# Altium project Aeon Lite.PrjPcb
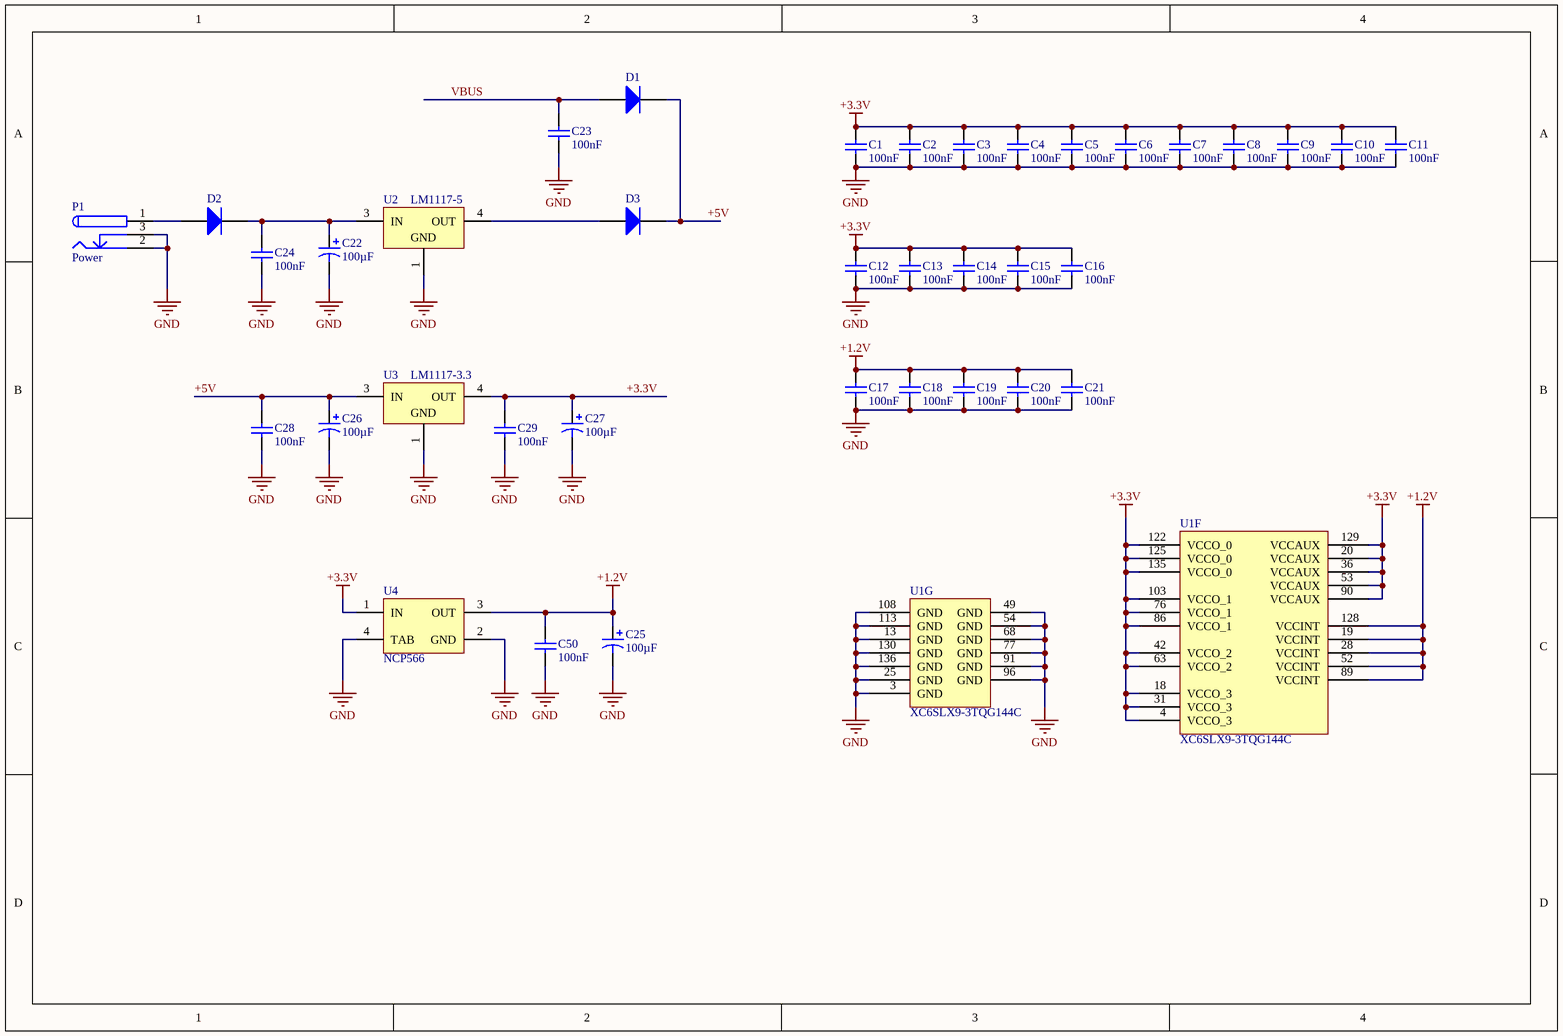
[diagram p0: Power Supply.SchDoc]
6 sheets, 165 parts. Net scope: global (net labels, ports and power ports of the same name join across sheets).
Board file: Board.PcbDoc
Sheets:
  Power Supply.SchDoc
  FPGA Banks.SchDoc
  Memory.SchDoc
  Controller.SchDoc
  VGA.SchDoc
  PS2.SchDoc

## Sheet Power Supply.SchDoc
size A4

### Parts
C1  value 100nF  [6-0805_n]  (hidden comment: Cap)
C2  value 100nF  [6-0805_n]  (hidden comment: Cap)
C3  value 100nF  [6-0805_n]  (hidden comment: Cap)
C4  value 100nF  [6-0805_n]  (hidden comment: Cap)
C5  value 100nF  [6-0805_n]  (hidden comment: Cap)
C6  value 100nF  [6-0805_n]  (hidden comment: Cap)
C7  value 100nF  [6-0805_n]  (hidden comment: Cap)
C8  value 100nF  [6-0805_n]  (hidden comment: Cap)
C9  value 100nF  [6-0805_n]  (hidden comment: Cap)
C10  value 100nF  [6-0805_n]  (hidden comment: Cap)
C11  value 100nF  [6-0805_n]  (hidden comment: Cap)
C12  value 100nF  [6-0805_n]  (hidden comment: Cap)
C13  value 100nF  [6-0805_n]  (hidden comment: Cap)
C14  value 100nF  [6-0805_n]  (hidden comment: Cap)
C15  value 100nF  [6-0805_n]  (hidden comment: Cap)
C16  value 100nF  [6-0805_n]  (hidden comment: Cap)
C17  value 100nF  [6-0805_n]  (hidden comment: Cap)
C18  value 100nF  [6-0805_n]  (hidden comment: Cap)
C19  value 100nF  [6-0805_n]  (hidden comment: Cap)
C20  value 100nF  [6-0805_n]  (hidden comment: Cap)
C21  value 100nF  [6-0805_n]  (hidden comment: Cap)
C22  value 100µF  [ECAP 6.3mm]  (hidden comment: Cap Pol3)
C23  value 100nF  [6-0805_n]  (hidden comment: Cap)
C24  value 100nF  [6-0805_n]  (hidden comment: Cap)
C25  value 100µF  [ECAP 6.3mm]  (hidden comment: Cap Pol3)
C26  value 100µF  [ECAP 6.3mm]  (hidden comment: Cap Pol3)
C27  value 100µF  [ECAP 6.3mm]  (hidden comment: Cap Pol3)
C28  value 100nF  [6-0805_n]  (hidden comment: Cap)
C29  value 100nF  [6-0805_n]  (hidden comment: Cap)
C50  value 100nF  [6-0805_n]  (hidden comment: Cap)
D1  Diode  [SMB]  (value not drawn)
D2  Diode  [SMB]  (value not drawn)
D3  Diode  [SMB]  (value not drawn)
P1  Power  [Power Jack]
U1  XC6SLX9-3TQG144C  [TQG144_N]  (parts F,G of 7)
U2  LM1117-5  [TD03B_M]
U3  LM1117-3.3  [TD03B_M]
U4  NCP566  [SOT223]

### Nets
+1.2V: C17.2 C18.2 C19.2 C20.2 C21.2 C25.1 C50.2 U1.19(VCCINT) U1.28(VCCINT) U1.52(VCCINT) U1.89(VCCINT) U1.128(VCCINT) U4.3(OUT)
+3.3V: C1.2 C2.2 C3.2 C4.2 C5.2 C6.2 C7.2 C8.2 C9.2 C10.2 C11.2 C12.2 C13.2 C14.2 C15.2 C16.2 C27.1 C29.2 U1.4(VCCO_3) U1.18(VCCO_3) U1.20(VCCAUX) U1.31(VCCO_3) U1.36(VCCAUX) U1.42(VCCO_2) U1.53(VCCAUX) U1.63(VCCO_2) U1.76(VCCO_1) U1.86(VCCO_1) U1.90(VCCAUX) U1.103(VCCO_1) U1.122(VCCO_0) U1.125(VCCO_0) U1.129(VCCAUX) U1.135(VCCO_0) U3.4(OUT) U4.1(IN)
+5V: C26.1 C28.2 D1.2(K) D3.2(K) U3.3(IN)
GND: C1.1 C2.1 C3.1 C4.1 C5.1 C6.1 C7.1 C8.1 C9.1 C10.1 C11.1 C12.1 C13.1 C14.1 C15.1 C16.1 C17.1 C18.1 C19.1 C20.1 C21.1 C22.2 C23.1 C24.1 C25.2 C26.2 C27.2 C28.1 C29.1 C50.1 P1.2 P1.3 U1.3(GND) U1.13(GND) U1.25(GND) U1.49(GND) U1.54(GND) U1.68(GND) U1.77(GND) U1.91(GND) U1.96(GND) U1.108(GND) U1.113(GND) U1.130(GND) U1.136(GND) U2.1(GND) U3.1(GND) U4.2(GND) U4.4(TAB)
VBUS: C23.2 D1.1(A)
NetC22_1: C22.1 C24.2 D2.2(K) U2.3(IN)
NetD2_1: D2.1(A) P1.1
NetD3_1: D3.1(A) U2.4(OUT)

### Notes on the sheet
- Title
- Size:
- Date:
- A4
- Number:
- Time:
- Revision:
- Sheet
- of
- File:

### Library data of the parts
C1-C21 C23 C24 C28 C29 C50 = Cap: Capacitor; Published: 8-Jun-2000; LatestRevisionDate: 17-Jul-2002; LatestRevisionNote: Re-released for DXP Platform.; PackageReference: RAD-0.3; Publisher: Altium Limited; PackageDescription: Radial Cap, Thru-Hole; 2 Leads; 0.3 in Pin Spacing
C22 C25-C27 = Cap Pol3: Polarized Capacitor (Surface Mount); Published: 8-Jun-2000; LatestRevisionDate: 29-May-2009; LatestRevisionNote: IPC-7351 Footprint Added.; PackageReference: C0805; Publisher: Altium Limited; PackageDescription: Chip Capacitor
D1-D3 = Diode: Default Diode; Published: 8-Jun-2000; LatestRevisionDate: 17-Jul-2002; LatestRevisionNote: Re-released for DXP Platform.; PackageVersion: Sep-1996; PackageReference: SMC; Publisher: Altium Limited; PackageDescription: DO-214-AB/SMC; 2 C-Bend Leads; Body 7.9 x 5.9 mm, inc. leads (LxW); Code_JEDEC: DO-214-AB
P1 = Power Jack
U1 = XC6SLX9-3TQG144C: Spartan-6 LX 1.2V FPGA, 102 User I/Os, 144-Pin TQFP (0.5mm Pitch), Speed Grade 3, Commercial Grade, Pb-Free; Published: 17-Nov-2009; DatasheetVersion: ver1.6, Nov-2010; PackageVersion: ver1.2, Jun-2004; PackageReference: TQG144; Publisher: Altium Limited; PackageDescription: 144-Pin Thin Quad Flat Pack (TQG144) - Pb-Free; Supplier 1: Digi-Key; Supplier Part Number 1: XC6SLX9-3TQG144C-ND; Code_JEDEC: MS-026-BFB; ComponentLink1Description: Manufacturer Link; ComponentLink1URL: http://www.xilinx.com; ComponentLink2Description: Spartan-6 Datasheet; ComponentLink2URL: http://www.xilinx.com/support/documentation/data_sheets/ds160.pdf; ComponentLink3Description: Spartan-6 Documents; ComponentLink3URL: http://www.xilinx.com/support/documentation/spartan-6.htm; ComponentLink4Description: Xilinx.com Home; ComponentLink4URL: http://www.xilinx.com
U2 U3 = LM1117DT-3.3: 800mA Low-Dropout Linear Regulator, 3-pin TO-252; Manufacturer: National Semiconductor; PackageTopMarking: NSUZXYTT*LM1117*DT-3.3; PowerWise: N; CompType: LDO IC; Published: 4-Dec-2008; DatasheetVersion: Apr-2006; PackageVersion: revD, Feb-2009; PackageReference: TD03B; Publisher: Altium Limited; PackageDescription: TO252, Molded, Jedec, 6.8 x 6.10 x 2.30mm Body, 3 Lead, 2.28mm Pitch, Surface Mount; Supplier 1: Farnell; Supplier Part Number 1: 9486275; Supplier 2: Farnell; Supplier Part Number 2: 1523829; PartNumber: LM1117DT-3.3; RoHS: N; PinCount: 3; Code_JEDEC: TO-252-AA; ComponentLink1Description: LM1117 Datasheet; ComponentLink1URL: http://www.national.com/ds/LM/LM1117.pdf; ComponentLink2Description: LM1117 Web Page; ComponentLink2URL: http://www.national.com/pf/LM/LM1117.html; ComponentLink3Description: TD03B Package Page; ComponentLink3URL: http://www.national.com/packaging/folders/td03b.html

## Sheet FPGA Banks.SchDoc
size A4
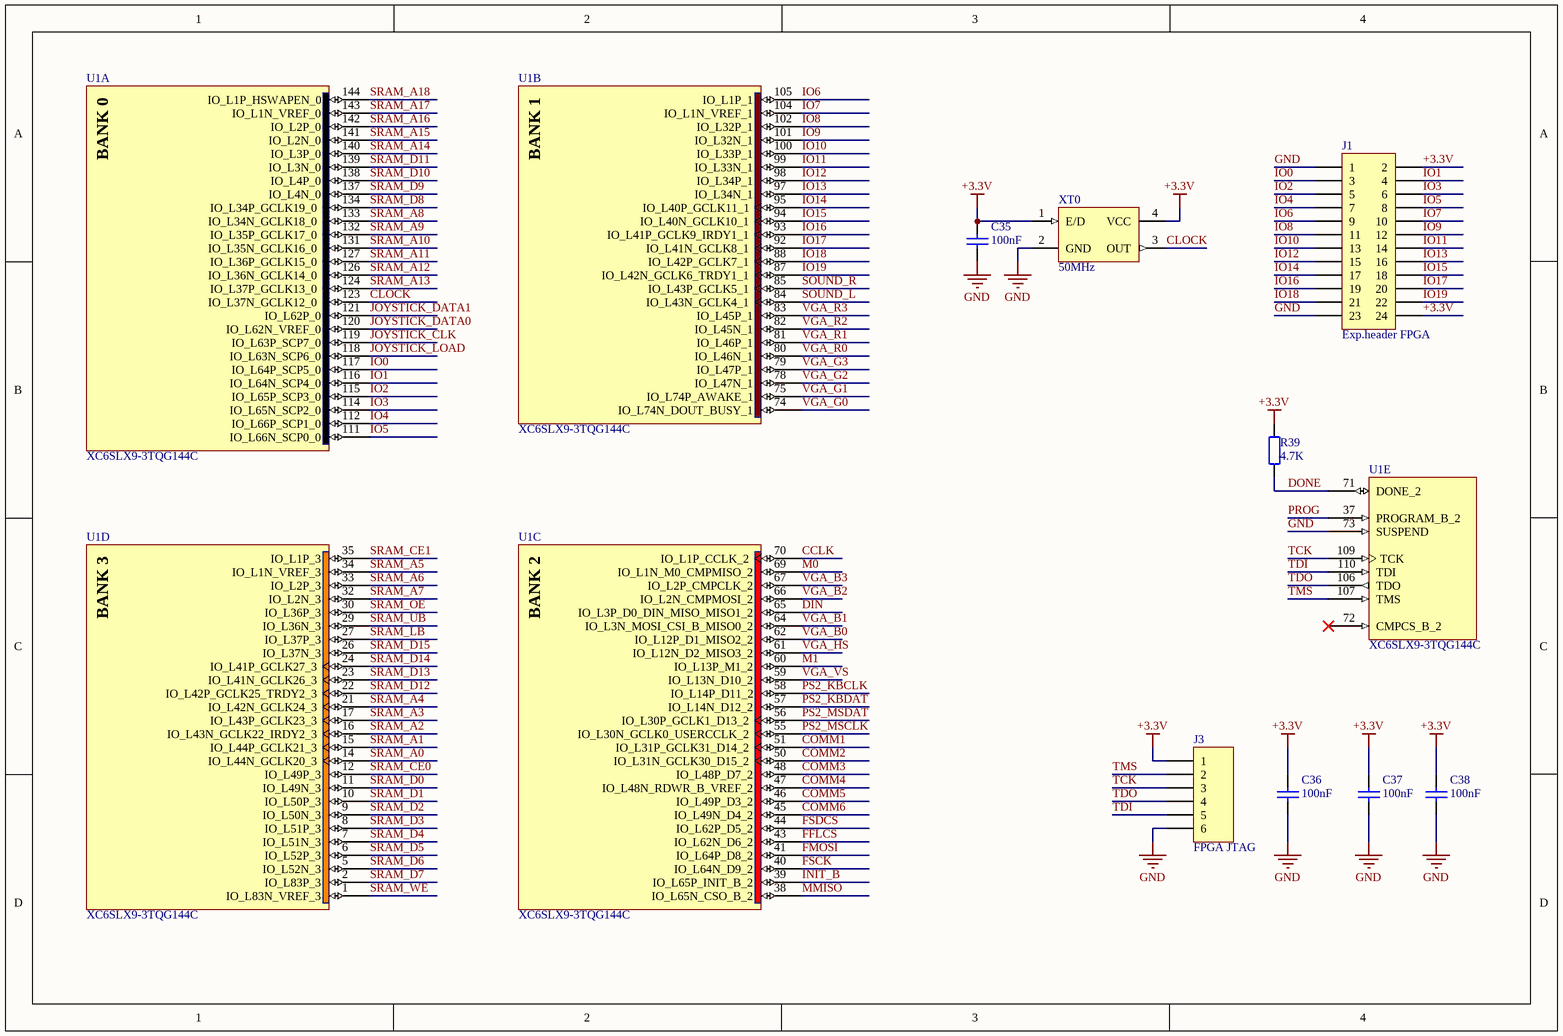
[diagram p1: FPGA Banks.SchDoc]

### Parts
C35  value 100nF  [6-0805_n]  (hidden comment: Cap)
C36  value 100nF  [6-0805_n]  (hidden comment: Cap)
C37  value 100nF  [6-0805_n]  (hidden comment: Cap)
C38  value 100nF  [6-0805_n]  (hidden comment: Cap)
J1  Exp.header FPGA  [HDR2X12]
J3  FPGA JTAG  [HDR1X6]
R39  value 4.7K  [6-0805_N]  (hidden comment: Res2)
U1  XC6SLX9-3TQG144C  [TQG144_N]  (parts A,B,C,D,E of 7)
XT0  value 50MHz  [Oscillator SMD 7x5mm]  (hidden comment: Oscillator)

### Nets
+3.3V: C35.2 C36.2 C37.2 C38.2 J1.2 J1.24 J3.1 R39.1 XT0.1(E/D) XT0.4(VCC)
GND: C35.1 C36.1 C37.1 C38.1 J1.1 J1.23 J3.6 U1.73(SUSPEND) XT0.2(GND)
CCLK: U1.70(IO_L1P_CCLK_2)
CLOCK: U1.123(IO_L37N_GCLK12_0) XT0.3(OUT)
COMM1: U1.51(IO_L31P_GCLK31_D14_2)
COMM2: U1.50(IO_L31N_GCLK30_D15_2)
COMM3: U1.48(IO_L48P_D7_2)
COMM4: U1.47(IO_L48N_RDWR_B_VREF_2)
COMM5: U1.46(IO_L49P_D3_2)
COMM6: U1.45(IO_L49N_D4_2)
DIN: U1.65(IO_L3P_D0_DIN_MISO_MISO1_2)
DONE: R39.2 U1.71(DONE_2)
FFLCS: U1.43(IO_L62N_D6_2)
FMOSI: U1.41(IO_L64P_D8_2)
FSCK: U1.40(IO_L64N_D9_2)
FSDCS: U1.44(IO_L62P_D5_2)
INIT_B: U1.39(IO_L65P_INIT_B_2)
IO0: J1.3 U1.117(IO_L64P_SCP5_0)
IO1: J1.4 U1.116(IO_L64N_SCP4_0)
IO2: J1.5 U1.115(IO_L65P_SCP3_0)
IO3: J1.6 U1.114(IO_L65N_SCP2_0)
IO4: J1.7 U1.112(IO_L66P_SCP1_0)
IO5: J1.8 U1.111(IO_L66N_SCP0_0)
IO6: J1.9 U1.105(IO_L1P_1)
IO7: J1.10 U1.104(IO_L1N_VREF_1)
IO8: J1.11 U1.102(IO_L32P_1)
IO9: J1.12 U1.101(IO_L32N_1)
IO10: J1.13 U1.100(IO_L33P_1)
IO11: J1.14 U1.99(IO_L33N_1)
IO12: J1.15 U1.98(IO_L34P_1)
IO13: J1.16 U1.97(IO_L34N_1)
IO14: J1.17 U1.95(IO_L40P_GCLK11_1)
IO15: J1.18 U1.94(IO_L40N_GCLK10_1)
IO16: J1.19 U1.93(IO_L41P_GCLK9_IRDY1_1)
IO17: J1.20 U1.92(IO_L41N_GCLK8_1)
IO18: J1.21 U1.88(IO_L42P_GCLK7_1)
IO19: J1.22 U1.87(IO_L42N_GCLK6_TRDY1_1)
JOYSTICK_CLK: U1.119(IO_L63P_SCP7_0)
JOYSTICK_DATA0: U1.120(IO_L62N_VREF_0)
JOYSTICK_DATA1: U1.121(IO_L62P_0)
JOYSTICK_LOAD: U1.118(IO_L63N_SCP6_0)
M0: U1.69(IO_L1N_M0_CMPMISO_2)
M1: U1.60(IO_L13P_M1_2)
MMISO: U1.38(IO_L65N_CSO_B_2)
PROG: U1.37(PROGRAM_B_2)
PS2_KBCLK: U1.58(IO_L14P_D11_2)
PS2_KBDAT: U1.57(IO_L14N_D12_2)
PS2_MSCLK: U1.55(IO_L30N_GCLK0_USERCCLK_2)
PS2_MSDAT: U1.56(IO_L30P_GCLK1_D13_2)
SOUND_L: U1.84(IO_L43N_GCLK4_1)
SOUND_R: U1.85(IO_L43P_GCLK5_1)
SRAM_A0: U1.14(IO_L44N_GCLK20_3)
SRAM_A1: U1.15(IO_L44P_GCLK21_3)
SRAM_A2: U1.16(IO_L43N_GCLK22_IRDY2_3)
SRAM_A3: U1.17(IO_L43P_GCLK23_3)
SRAM_A4: U1.21(IO_L42N_GCLK24_3)
SRAM_A5: U1.34(IO_L1N_VREF_3)
SRAM_A6: U1.33(IO_L2P_3)
SRAM_A7: U1.32(IO_L2N_3)
SRAM_A8: U1.133(IO_L34N_GCLK18_0)
SRAM_A9: U1.132(IO_L35P_GCLK17_0)
SRAM_A10: U1.131(IO_L35N_GCLK16_0)
SRAM_A11: U1.127(IO_L36P_GCLK15_0)
SRAM_A12: U1.126(IO_L36N_GCLK14_0)
SRAM_A13: U1.124(IO_L37P_GCLK13_0)
SRAM_A14: U1.140(IO_L3P_0)
SRAM_A15: U1.141(IO_L2N_0)
SRAM_A16: U1.142(IO_L2P_0)
SRAM_A17: U1.143(IO_L1N_VREF_0)
SRAM_A18: U1.144(IO_L1P_HSWAPEN_0)
SRAM_CE0: U1.12(IO_L49P_3)
SRAM_CE1: U1.35(IO_L1P_3)
SRAM_D0: U1.11(IO_L49N_3)
SRAM_D1: U1.10(IO_L50P_3)
SRAM_D2: U1.9(IO_L50N_3)
SRAM_D3: U1.8(IO_L51P_3)
SRAM_D4: U1.7(IO_L51N_3)
SRAM_D5: U1.6(IO_L52P_3)
SRAM_D6: U1.5(IO_L52N_3)
SRAM_D7: U1.2(IO_L83P_3)
SRAM_D8: U1.134(IO_L34P_GCLK19_0)
SRAM_D9: U1.137(IO_L4N_0)
SRAM_D10: U1.138(IO_L4P_0)
SRAM_D11: U1.139(IO_L3N_0)
SRAM_D12: U1.22(IO_L42P_GCLK25_TRDY2_3)
SRAM_D13: U1.23(IO_L41N_GCLK26_3)
SRAM_D14: U1.24(IO_L41P_GCLK27_3)
SRAM_D15: U1.26(IO_L37N_3)
SRAM_LB: U1.27(IO_L37P_3)
SRAM_OE: U1.30(IO_L36P_3)
SRAM_UB: U1.29(IO_L36N_3)
SRAM_WE: U1.1(IO_L83N_VREF_3)
TCK: J3.3 U1.109(TCK)
TDI: J3.5 U1.110(TDI)
TDO: J3.4 U1.106(TDO)
TMS: J3.2 U1.107(TMS)
VGA_B0: U1.62(IO_L12P_D1_MISO2_2)
VGA_B1: U1.64(IO_L3N_MOSI_CSI_B_MISO0_2)
VGA_B2: U1.66(IO_L2N_CMPMOSI_2)
VGA_B3: U1.67(IO_L2P_CMPCLK_2)
VGA_G0: U1.74(IO_L74N_DOUT_BUSY_1)
VGA_G1: U1.75(IO_L74P_AWAKE_1)
VGA_G2: U1.78(IO_L47N_1)
VGA_G3: U1.79(IO_L47P_1)
VGA_HS: U1.61(IO_L12N_D2_MISO3_2)
VGA_R0: U1.80(IO_L46N_1)
VGA_R1: U1.81(IO_L46P_1)
VGA_R2: U1.82(IO_L45N_1)
VGA_R3: U1.83(IO_L45P_1)
VGA_VS: U1.59(IO_L13N_D10_2)

Not connected (* = marked no-connect by the designer): U1 72(CMPCS_B_2)*

### Notes on the sheet
- Title
- Size:
- Date:
- A4
- Number:
- Time:
- Revision:
- Sheet
- of
- File:
- (in symbol XC6SLX9-3TQG144C, part A) BANK 0
- (in symbol XC6SLX9-3TQG144C, part B) BANK 1
- (in symbol XC6SLX9-3TQG144C, part C) BANK 2
- (in symbol XC6SLX9-3TQG144C, part D) BANK 3

### Library data of the parts
C35-C38 = Cap: Capacitor; Published: 8-Jun-2000; LatestRevisionDate: 17-Jul-2002; LatestRevisionNote: Re-released for DXP Platform.; PackageReference: RAD-0.3; Publisher: Altium Limited; PackageDescription: Radial Cap, Thru-Hole; 2 Leads; 0.3 in Pin Spacing
J1 = Header 12X2: Header, 12-Pin, Dual row; LatestRevisionDate: 17-Jul-2002; LatestRevisionNote: Re-released for DXP Platform.; Publisher: Altium Limited
J3 = Header 6: Header, 6-Pin; LatestRevisionDate: 17-Jul-2002; LatestRevisionNote: Re-released for DXP Platform.; Publisher: Altium Limited
R39 = Res2: Resistor; Published: 8-Jun-2000; LatestRevisionDate: 17-Jul-2002; LatestRevisionNote: Re-released for DXP Platform.; PackageReference: AXIAL-0.4; Publisher: Altium Limited; PackageDescription: Axial Device, Thru-Hole; 2 Leads; 0.4 in Pin Spacing
U1 = XC6SLX9-3TQG144C: as U1 on sheet Power Supply; Published: 17-Nov-2009; DatasheetVersion: ver1.6, Nov-2010; PackageVersion: ver1.2, Jun-2004; PackageReference: TQG144; Publisher: Altium Limited; PackageDescription: 144-Pin Thin Quad Flat Pack (TQG144) - Pb-Free; Supplier 1: Digi-Key; Supplier Part Number 1: XC6SLX9-3TQG144C-ND; Code_JEDEC: MS-026-BFB; ComponentLink1Description: Manufacturer Link; ComponentLink1URL: http://www.xilinx.com; ComponentLink2Description: Spartan-6 Datasheet; ComponentLink2URL: http://www.xilinx.com/support/documentation/data_sheets/ds160.pdf; ComponentLink3Description: Spartan-6 Documents; ComponentLink3URL: http://www.xilinx.com/support/documentation/spartan-6.htm; ComponentLink4Description: Xilinx.com Home; ComponentLink4URL: http://www.xilinx.com

## Sheet Memory.SchDoc
size A4
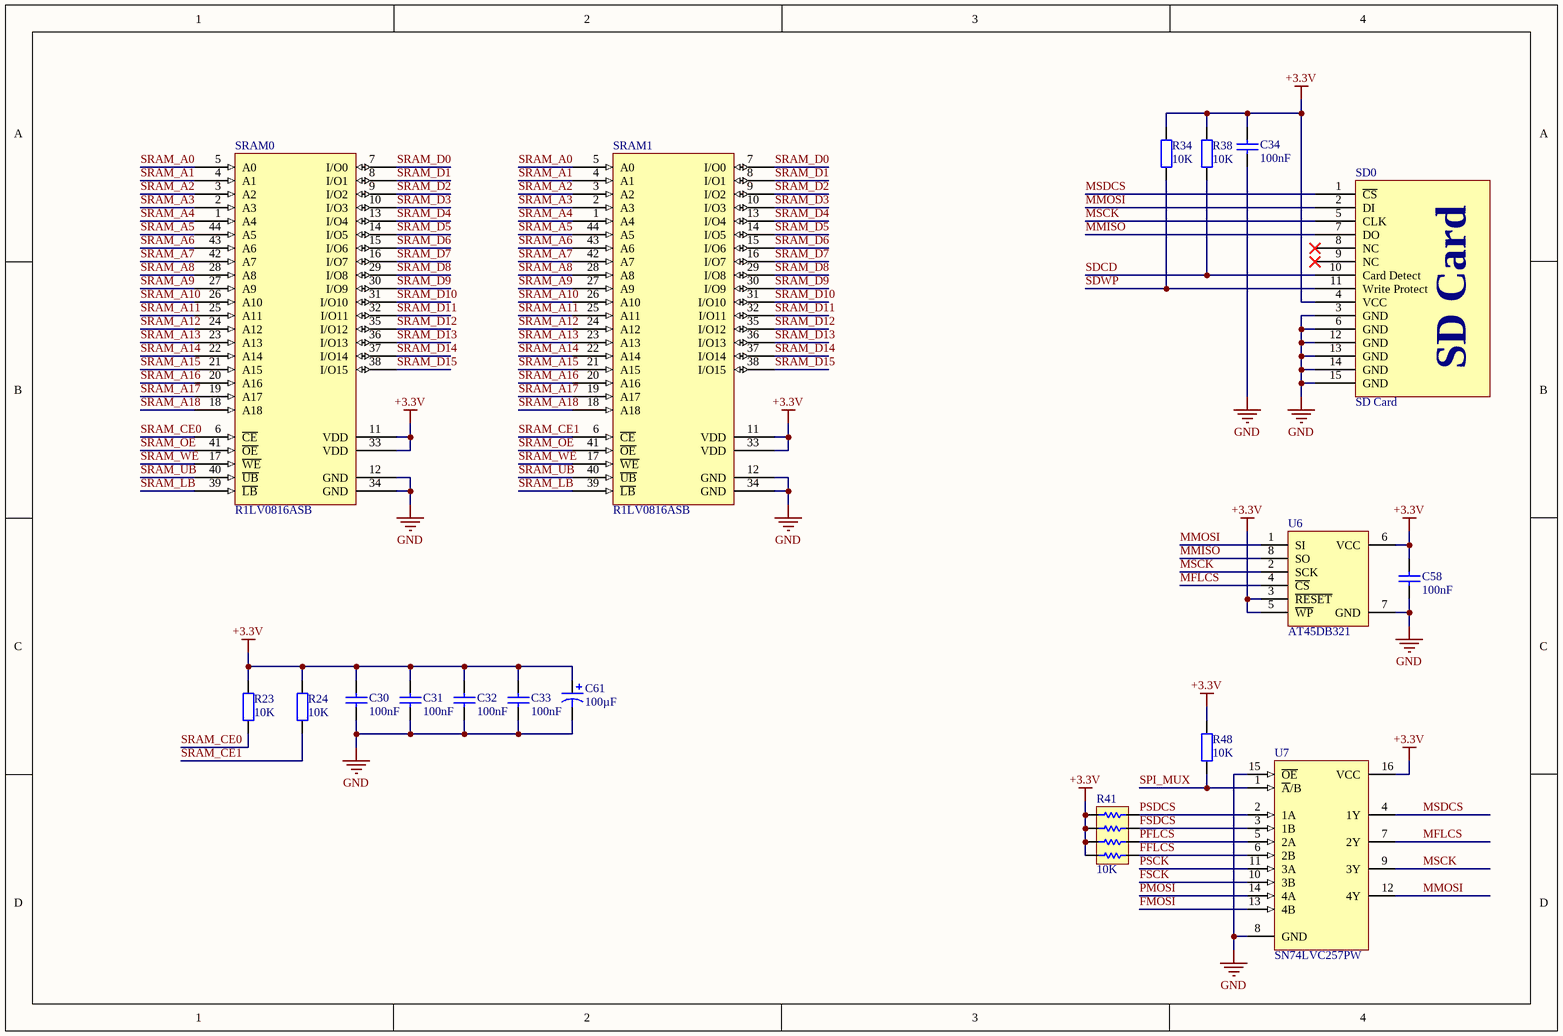
[diagram p2: Memory.SchDoc]

### Parts
C30  value 100nF  [6-0805_n]  (hidden comment: Cap)
C31  value 100nF  [6-0805_n]  (hidden comment: Cap)
C32  value 100nF  [6-0805_n]  (hidden comment: Cap)
C33  value 100nF  [6-0805_n]  (hidden comment: Cap)
C34  value 100nF  [6-0805_n]  (hidden comment: Cap)
C58  value 100nF  [6-0805_n]  (hidden comment: Cap)
C61  value 100µF  [ECAP 6.3mm]  (hidden comment: Cap Pol3)
R23  value 10K  [6-0805_N]  (hidden comment: Res2)
R24  value 10K  [6-0805_N]  (hidden comment: Res2)
R34  value 10K  [6-0805_N]  (hidden comment: Res2)
R38  value 10K  [6-0805_N]  (hidden comment: Res2)
R41  10K  [SMD 4 Resisor Network]
R48  value 10K  [6-0805_N]  (hidden comment: Res2)
SD0  SD Card  [SD-Card Connector OK]
SRAM0  R1LV0816ASB  [TSOP44]
SRAM1  R1LV0816ASB  [TSOP44]
U6  AT45DB321  [SOIC8]
U7  SN74LVC257PW  [PW016_N]

### Nets
+3.3V: C30.2 C31.2 C32.2 C33.2 C34.2 C58.2 C61.1 R23.1 R24.1 R34.1 R38.1 R41.1 R41.3 R41.5 R41.7 R48.1 SD0.4(VCC) SRAM0.11(VDD) SRAM0.33(VDD) SRAM1.11(VDD) SRAM1.33(VDD) U6.3(~{RESET}) U6.5(~{WP}) U6.6(VCC) U7.16(VCC)
GND: C30.1 C31.1 C32.1 C33.1 C34.1 C58.1 C61.2 SD0.3(GND) SD0.6(GND) SD0.12(GND) SD0.13(GND) SD0.14(GND) SD0.15(GND) SRAM0.12(GND) SRAM0.34(GND) SRAM1.12(GND) SRAM1.34(GND) U6.7(GND) U7.8(GND) U7.15(~{OE})
FFLCS: R41.8 U7.6(2B)
FMOSI: U7.13(4B)
FSCK: U7.10(3B)
FSDCS: R41.4 U7.3(1B)
MFLCS: U6.4(~{CS}) U7.7(2Y)
MMISO: SD0.7(DO) U6.8(SO)
MMOSI: SD0.2(DI) U6.1(SI) U7.12(4Y)
MSCK: SD0.5(CLK) U6.2(SCK) U7.9(3Y)
MSDCS: SD0.1(~{CS}) U7.4(1Y)
PFLCS: R41.6 U7.5(2A)
PMOSI: U7.14(4A)
PSCK: U7.11(3A)
PSDCS: R41.2 U7.2(1A)
SDCD: R38.2 SD0.10(Card_Detect)
SDWP: R34.2 SD0.11(Write_Protect)
SPI_MUX: R48.2 U7.1(~{A}/B)
SRAM_A0: SRAM0.5(A0) SRAM1.5(A0)
SRAM_A1: SRAM0.4(A1) SRAM1.4(A1)
SRAM_A2: SRAM0.3(A2) SRAM1.3(A2)
SRAM_A3: SRAM0.2(A3) SRAM1.2(A3)
SRAM_A4: SRAM0.1(A4) SRAM1.1(A4)
SRAM_A5: SRAM0.44(A5) SRAM1.44(A5)
SRAM_A6: SRAM0.43(A6) SRAM1.43(A6)
SRAM_A7: SRAM0.42(A7) SRAM1.42(A7)
SRAM_A8: SRAM0.28(A8) SRAM1.28(A8)
SRAM_A9: SRAM0.27(A9) SRAM1.27(A9)
SRAM_A10: SRAM0.26(A10) SRAM1.26(A10)
SRAM_A11: SRAM0.25(A11) SRAM1.25(A11)
SRAM_A12: SRAM0.24(A12) SRAM1.24(A12)
SRAM_A13: SRAM0.23(A13) SRAM1.23(A13)
SRAM_A14: SRAM0.22(A14) SRAM1.22(A14)
SRAM_A15: SRAM0.21(A15) SRAM1.21(A15)
SRAM_A16: SRAM0.20(A16) SRAM1.20(A16)
SRAM_A17: SRAM0.19(A17) SRAM1.19(A17)
SRAM_A18: SRAM0.18(A18) SRAM1.18(A18)
SRAM_CE0: R23.2 SRAM0.6(~{CE})
SRAM_CE1: R24.2 SRAM1.6(~{CE})
SRAM_D0: SRAM0.7(I/O0) SRAM1.7(I/O0)
SRAM_D1: SRAM0.8(I/O1) SRAM1.8(I/O1)
SRAM_D2: SRAM0.9(I/O2) SRAM1.9(I/O2)
SRAM_D3: SRAM0.10(I/O3) SRAM1.10(I/O3)
SRAM_D4: SRAM0.13(I/O4) SRAM1.13(I/O4)
SRAM_D5: SRAM0.14(I/O5) SRAM1.14(I/O5)
SRAM_D6: SRAM0.15(I/O6) SRAM1.15(I/O6)
SRAM_D7: SRAM0.16(I/O7) SRAM1.16(I/O7)
SRAM_D8: SRAM0.29(I/O8) SRAM1.29(I/O8)
SRAM_D9: SRAM0.30(I/O9) SRAM1.30(I/O9)
SRAM_D10: SRAM0.31(I/O10) SRAM1.31(I/O10)
SRAM_D11: SRAM0.32(I/O11) SRAM1.32(I/O11)
SRAM_D12: SRAM0.35(I/O12) SRAM1.35(I/O12)
SRAM_D13: SRAM0.36(I/O13) SRAM1.36(I/O13)
SRAM_D14: SRAM0.37(I/O14) SRAM1.37(I/O14)
SRAM_D15: SRAM0.38(I/O15) SRAM1.38(I/O15)
SRAM_LB: SRAM0.39(~{LB}) SRAM1.39(~{LB})
SRAM_OE: SRAM0.41(~{OE}) SRAM1.41(~{OE})
SRAM_UB: SRAM0.40(~{UB}) SRAM1.40(~{UB})
SRAM_WE: SRAM0.17(~{WE}) SRAM1.17(~{WE})

Not connected (* = marked no-connect by the designer): SD0 8(NC)* 9(NC)*

### Notes on the sheet
- Title
- Size:
- Date:
- A4
- Number:
- Time:
- Revision:
- Sheet
- of
- File:

### Library data of the parts
C30-C34 C58 = Cap: Capacitor; Published: 8-Jun-2000; LatestRevisionDate: 17-Jul-2002; LatestRevisionNote: Re-released for DXP Platform.; PackageReference: RAD-0.3; Publisher: Altium Limited; PackageDescription: Radial Cap, Thru-Hole; 2 Leads; 0.3 in Pin Spacing
C61 = Cap Pol3: Polarized Capacitor (Surface Mount); Published: 8-Jun-2000; LatestRevisionDate: 29-May-2009; LatestRevisionNote: IPC-7351 Footprint Added.; PackageReference: C0805; Publisher: Altium Limited; PackageDescription: Chip Capacitor
R23 R24 R34 R38 R48 = Res2: Resistor; Published: 8-Jun-2000; LatestRevisionDate: 17-Jul-2002; LatestRevisionNote: Re-released for DXP Platform.; PackageReference: AXIAL-0.4; Publisher: Altium Limited; PackageDescription: Axial Device, Thru-Hole; 2 Leads; 0.4 in Pin Spacing
R41 = SMD 4 Resistor Network
SD0 = SD Card Connector
SRAM0 SRAM1 = R1LV0816ASB: 8Mbit (512Kb x 16) Asynchron Static RAM
U6 = AT45DB321D
U7 = SN74LVC257PW: Quadruple 2-Line to 1-Line Data Selector/Multiplexer with 3-State Outputs; ComponentAvailability: Not Available; Published: 8-Jun-2000; LatestRevisionDate: 29-Mar-2007; LatestRevisionNote: IPC-7351 Footprint Added.; DatasheetVersion: Jul-1995; PackageVersion: Feb-1999; PackageReference: PW016; Publisher: Altium Limited; PackageDescription: 16-Pin Thin Small Outline Package 0.65 mm Pitch; ComponentLink1Description: Manufacturer Link; ComponentLink1URL: http://www.ti.com/; ComponentLink2Description: Discontinuation Notice; ComponentLink2URL: http://focus.ti.com/pdfs/mltry/obsolete.pdf

## Sheet Controller.SchDoc
size A4
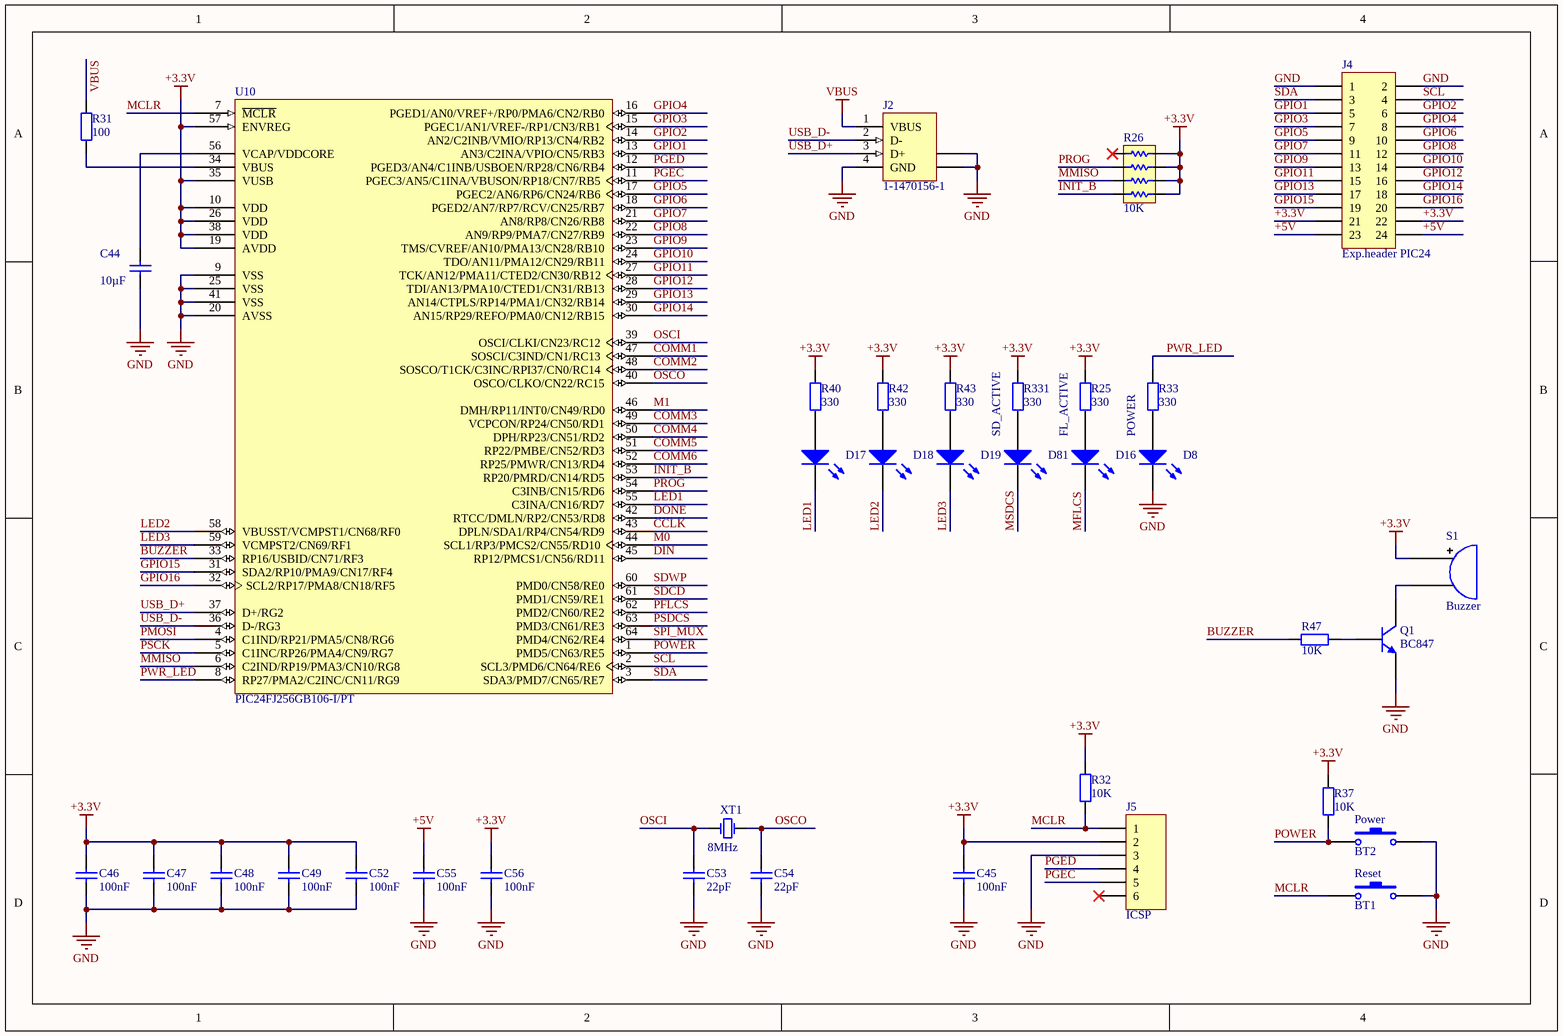
[diagram p3: Controller.SchDoc]

### Parts
C44  value 10µF  [6-0805_n]  (hidden comment: Cap)
C45  value 100nF  [6-0805_n]  (hidden comment: Cap)
C46  value 100nF  [6-0805_n]  (hidden comment: Cap)
C47  value 100nF  [6-0805_n]  (hidden comment: Cap)
C48  value 100nF  [6-0805_n]  (hidden comment: Cap)
C49  value 100nF  [6-0805_n]  (hidden comment: Cap)
C52  value 100nF  [6-0805_n]  (hidden comment: Cap)
C53  value 22pF  [6-0805_n]  (hidden comment: Cap)
C54  value 22pF  [6-0805_n]  (hidden comment: Cap)
C55  value 100nF  [6-0805_n]  (hidden comment: Cap)
C56  value 100nF  [6-0805_n]  (hidden comment: Cap)
D8  POWER  [HDR1X2]
D16  FL_ACTIVE  [HDR1X2]
D17  SD_ACTIVE  [6-0805_N]  (value not drawn)
D18  SD_ACTIVE  [6-0805_N]  (value not drawn)
D19  SD_ACTIVE  [6-0805_N]  (value not drawn)
D81  SD_ACTIVE  [HDR1X2]
J2  1-1470156-1  [440119]
J4  Exp.header PIC24  [HDR2X12]
J5  ICSP  [HDR1X6]
Power  BT2  [Push Button 6mm - Right Angle]
Q1  BC847  [SOT23_N]
R25  value 330  [6-0805_N]  (hidden comment: Res2)
R26  10K  [SMD 4 Resisor Network]
R31  value 100  [6-0805_N]  (hidden comment: Res2)
R32  value 10K  [6-0805_N]  (hidden comment: Res2)
R33  value 330  [6-0805_N]  (hidden comment: Res2)
R37  value 10K  [6-0805_N]  (hidden comment: Res2)
R40  value 330  [6-0805_N]  (hidden comment: Res2)
R42  value 330  [6-0805_N]  (hidden comment: Res2)
R43  value 330  [6-0805_N]  (hidden comment: Res2)
R47  value 10K  [RESC2012N]  (hidden comment: Resistor)
R331  value 330  [6-0805_N]  (hidden comment: Res2)
Reset  BT1  [Push Button 6mm]
S1  Buzzer  [Buzzer]
U10  PIC24FJ256GB106-I/PT  [TQFP-PT64_N]
XT1  value 8MHz  [Quartz HC-49]  (hidden comment: XTAL)

### Nets
+3.3V: C45.2 C46.1 C47.1 C48.1 C49.1 C52.1 C56.2 J4.21 J4.22 J5.2 R25.2 R26.2 R26.4 R26.6 R26.8 R32.2 R37.2 R40.2 R42.2 R43.2 R331.2 S1.1 U10.10(VDD) U10.19(AVDD) U10.26(VDD) U10.35(VUSB) U10.38(VDD) U10.57(ENVREG)
+5V: C55.2 J4.23 J4.24
GND: C44.1 C45.1 C46.2 C47.2 C48.2 C49.2 C52.2 C53.1 C54.1 C55.1 C56.1 D8.2(K) J2.4(GND) J2.5(SHLD) J2.6(SHLD) J4.1 J4.2 J5.3 Power.1 Q1.2(E) Reset.2 U10.9(VSS) U10.20(AVSS) U10.25(VSS) U10.41(VSS)
VBUS: J2.1(VBUS) R31.1
BUZZER: R47.1 U10.33(RP16/USBID/CN71/RF3)
CCLK: U10.43(DPLN/SDA1/RP4/CN54/RD9)
COMM1: U10.47(SOSCI/C3IND/CN1/RC13)
COMM2: U10.48(SOSCO/T1CK/C3INC/RPI37/CN0/RC14)
COMM3: U10.49(VCPCON/RP24/CN50/RD1)
COMM4: U10.50(DPH/RP23/CN51/RD2)
COMM5: U10.51(RP22/PMBE/CN52/RD3)
COMM6: U10.52(RP25/PMWR/CN13/RD4)
DIN: U10.45(RP12/PMCS1/CN56/RD11)
DONE: U10.42(RTCC/DMLN/RP2/CN53/RD8)
GPIO1: J4.5 U10.13(AN3/C2INA/VPIO/CN5/RB3)
GPIO2: J4.6 U10.14(AN2/C2INB/VMIO/RP13/CN4/RB2)
GPIO3: J4.7 U10.15(PGEC1/AN1/VREF-/RP1/CN3/RB1)
GPIO4: J4.8 U10.16(PGED1/AN0/VREF+/RP0/PMA6/CN2/RB0)
GPIO5: J4.9 U10.17(PGEC2/AN6/RP6/CN24/RB6)
GPIO6: J4.10 U10.18(PGED2/AN7/RP7/RCV/CN25/RB7)
GPIO7: J4.11 U10.21(AN8/RP8/CN26/RB8)
GPIO8: J4.12 U10.22(AN9/RP9/PMA7/CN27/RB9)
GPIO9: J4.13 U10.23(TMS/CVREF/AN10/PMA13/CN28/RB10)
GPIO10: J4.14 U10.24(TDO/AN11/PMA12/CN29/RB11)
GPIO11: J4.15 U10.27(TCK/AN12/PMA11/CTED2/CN30/RB12)
GPIO12: J4.16 U10.28(TDI/AN13/PMA10/CTED1/CN31/RB13)
GPIO13: J4.17 U10.29(AN14/CTPLS/RP14/PMA1/CN32/RB14)
GPIO14: J4.18 U10.30(AN15/RP29/REFO/PMA0/CN12/RB15)
GPIO15: J4.19 U10.31(SDA2/RP10/PMA9/CN17/RF4)
GPIO16: J4.20 U10.32(SCL2/RP17/PMA8/CN18/RF5)
INIT_B: R26.7 U10.53(RP20/PMRD/CN14/RD5)
LED1: D17.2(K) U10.55(C3INA/CN16/RD7)
LED2: D18.2(K) U10.58(VBUSST/VCMPST1/CN68/RF0)
LED3: D19.2(K) U10.59(VCMPST2/CN69/RF1)
M0: U10.44(SCL1/RP3/PMCS2/CN55/RD10)
M1: U10.46(DMH/RP11/INT0/CN49/RD0)
MCLR: J5.1 R32.1 Reset.1 U10.7(~{MCLR})
MFLCS: D16.2(K)
MMISO: R26.5 U10.6(C2IND/RP19/PMA3/CN10/RG8)
MSDCS: D81.2(K)
OSCI: C53.2 U10.39(OSCI/CLKI/CN23/RC12) XT1.2(OSC2)
OSCO: C54.2 U10.40(OSCO/CLKO/CN22/RC15) XT1.1(OSC1)
PFLCS: U10.62(PMD2/CN60/RE2)
PGEC: J5.5 U10.11(PGEC3/AN5/C1INA/VBUSON/RP18/CN7/RB5)
PGED: J5.4 U10.12(PGED3/AN4/C1INB/USBOEN/RP28/CN6/RB4)
PMOSI: U10.4(C1IND/RP21/PMA5/CN8/RG6)
POWER: Power.2 R37.1 U10.1(PMD5/CN63/RE5)
PROG: R26.3 U10.54(C3INB/CN15/RD6)
PSCK: U10.5(C1INC/RP26/PMA4/CN9/RG7)
PSDCS: U10.63(PMD3/CN61/RE3)
PWR_LED: R33.2 U10.8(RP27/PMA2/C2INC/CN11/RG9)
SCL: J4.4 U10.2(SCL3/PMD6/CN64/RE6)
SDA: J4.3 U10.3(SDA3/PMD7/CN65/RE7)
SDCD: U10.61(PMD1/CN59/RE1)
SDWP: U10.60(PMD0/CN58/RE0)
SPI_MUX: U10.64(PMD4/CN62/RE4)
USB_D+: J2.3(D+) U10.37(D+/RG2)
USB_D-: J2.2(D-) U10.36(D-/RG3)
NetC44_2: C44.2 U10.56(VCAP/VDDCORE)
NetD8_1: D8.1(A) R33.1
NetD16_1: D16.1(A) R25.1
NetD17_1: D17.1(A) R40.1
NetD18_1: D18.1(A) R42.1
NetD19_1: D19.1(A) R43.1
NetD81_1: D81.1(A) R331.1
NetQ1_1: Q1.1(B) R47.2
NetQ1_3: Q1.3(C) S1.2
NetR31_2: R31.2 U10.34(VBUS)

Not connected (* = marked no-connect by the designer): J5 6*; R26 1*

### Notes on the sheet
- Title
- Size:
- Date:
- A4
- Number:
- Time:
- Revision:
- Sheet
- of
- File:

### Library data of the parts
C44-C49 C52-C56 = Cap: Capacitor; Published: 8-Jun-2000; LatestRevisionDate: 17-Jul-2002; LatestRevisionNote: Re-released for DXP Platform.; PackageReference: RAD-0.3; Publisher: Altium Limited; PackageDescription: Radial Cap, Thru-Hole; 2 Leads; 0.3 in Pin Spacing
D8 D16-D19 D81 = LED0: Typical INFRARED GaAs LED; Published: 8-Jun-2000; LatestRevisionDate: 08-Jul-2005; LatestRevisionNote: Mech Layer 1 removed.; PackageReference: LED-0; Publisher: Altium Limited; PackageDescription: LED; 2 Leads
J2 = 1-1470156-1: USB 1.1, Right Angle, Thru-Hole, B Type, Receptacle, 4 Position, White; ContactMaterial: Phosphor Bronze; ContactPlating: Gold over Nickel; TerminationLength: 3.00mm [0.118in.]; PCB_Layout: Complies with manufacturer's recommendation.; DrillSize: Corresponds to nominal value.; PanelGround: Without; Published: 15-Jul-2004; DatasheetDocument: 02-Jun-2001; PackageDocument: 02-Jun-2001; PackageReference: 1-1470156; Publisher: Altium Limited; HousingMaterial: Glass-Filled Thermoplastic; ComponentLink1Description: Manufacturer Link; ComponentLink1URL: http://www.tycoelectronics.com/; ComponentLink2Description: Packaging Specification; ComponentLink2URL: http://ecommas.tycoelectronics.com/commerce/DocumentDelivery/DDEController?Action=showdoc&DocId=Customer+Drawing%7F1470156%7FO%7Ftif%7FEnglish%7FC_1470156_O.tif
J4 = Header 12X2: Header, 12-Pin, Dual row; LatestRevisionDate: 17-Jul-2002; LatestRevisionNote: Re-released for DXP Platform.; Publisher: Altium Limited
J5 = Header 6: Header, 6-Pin; LatestRevisionDate: 17-Jul-2002; LatestRevisionNote: Re-released for DXP Platform.; Publisher: Altium Limited
Power Reset = Push Button
Q1 = BF547: NPN 1 GHz Wideband Transistor; ComponentAvailability: Obsolete; Published: 17-Sep-2003; LatestRevisionDate: 12-Dec-2006; LatestRevisionNote: IPC-7351 Footprint Added.; DatasheetVersion: Sep-1995; PackageVersion: May-1999; PackageReference: SOT23; Publisher: Altium Limited; PackageDescription: 3-Pin SOT-23 Package 0.95 mm Pitch, 2.3 mm Lead Span; ComponentLink1Description: Manufacturer Link; ComponentLink1URL: http://www.semiconductors.philips.com/; ComponentLink2Description: Datasheet; ComponentLink2URL: http://www.semiconductors.philips.com/acrobat/datasheets/BF547_3.pdf; ComponentLink3Description: Discontinuation Notice; ComponentLink3URL: http://www.semiconductors.philips.com/pip/old/BF547.html
R25 R31-R33 R37 R40 R42 R43 R331 = Res2: Resistor; Published: 8-Jun-2000; LatestRevisionDate: 17-Jul-2002; LatestRevisionNote: Re-released for DXP Platform.; PackageReference: AXIAL-0.4; Publisher: Altium Limited; PackageDescription: Axial Device, Thru-Hole; 2 Leads; 0.4 in Pin Spacing
R26 = SMD 4 Resistor Network
S1 = Buzzer CEM-1206S/WT-1201: Magnetic Buzzer
U10 = PIC24FJ256GB106-I/PT: General Purpose 16-Bit Flash Microcontroller with USB On-The-Go, 256KB Flash, 16KB SRAM, 64-Pin TQFP, Industrial Temperature; Published: 29-Jan-2009; LatestRevisionDate: 07-Oct-2010; LatestRevisionNote: Updated to datasheet revision C, Dec-2009. Supplier links updated. Sch. pin names updated.; DatasheetVersion: revC, Dec-2009; PackageVersion: revBB, Aug-2009; PackageReference: TQFP-PT64; Publisher: Altium Limited; PackageDescription: 64-Lead Thin Plastic Quad Flat Pack (PT) - 10x10x1mm Body, 2.00mm [TQFP]; Supplier 1: Digi-Key; Supplier Part Number 1: PIC24FJ256GB106-I/PT-ND; Supplier 2: Farnell; Supplier Part Number 2: 1576868; Code_JEDEC: MS-026; ComponentLink1Description: Datasheet; ComponentLink1URL: http://ww1.microchip.com/downloads/en/DeviceDoc/39897c.pdf; ComponentLink2Description: Packaging Specification; ComponentLink2URL: http://www.microchip.com/stellent/groups/techpub_sg/documents/packagingspec/en012702.pdf; ComponentLink3Description: Microchip.com Home; ComponentLink3URL: http://www.microchip.com/
R47 = Resistor: Published: 8-Jun-2000; LatestRevisionDate: 17-Jul-2002; LatestRevisionNote: Re-released for DXP Platform.; PackageReference: AXIAL-0.4; Publisher: Altium Limited; PackageDescription: Axial Device, Thru-Hole; 2 Leads; 0.4 in Pin Spacing

## Sheet VGA.SchDoc
size A4
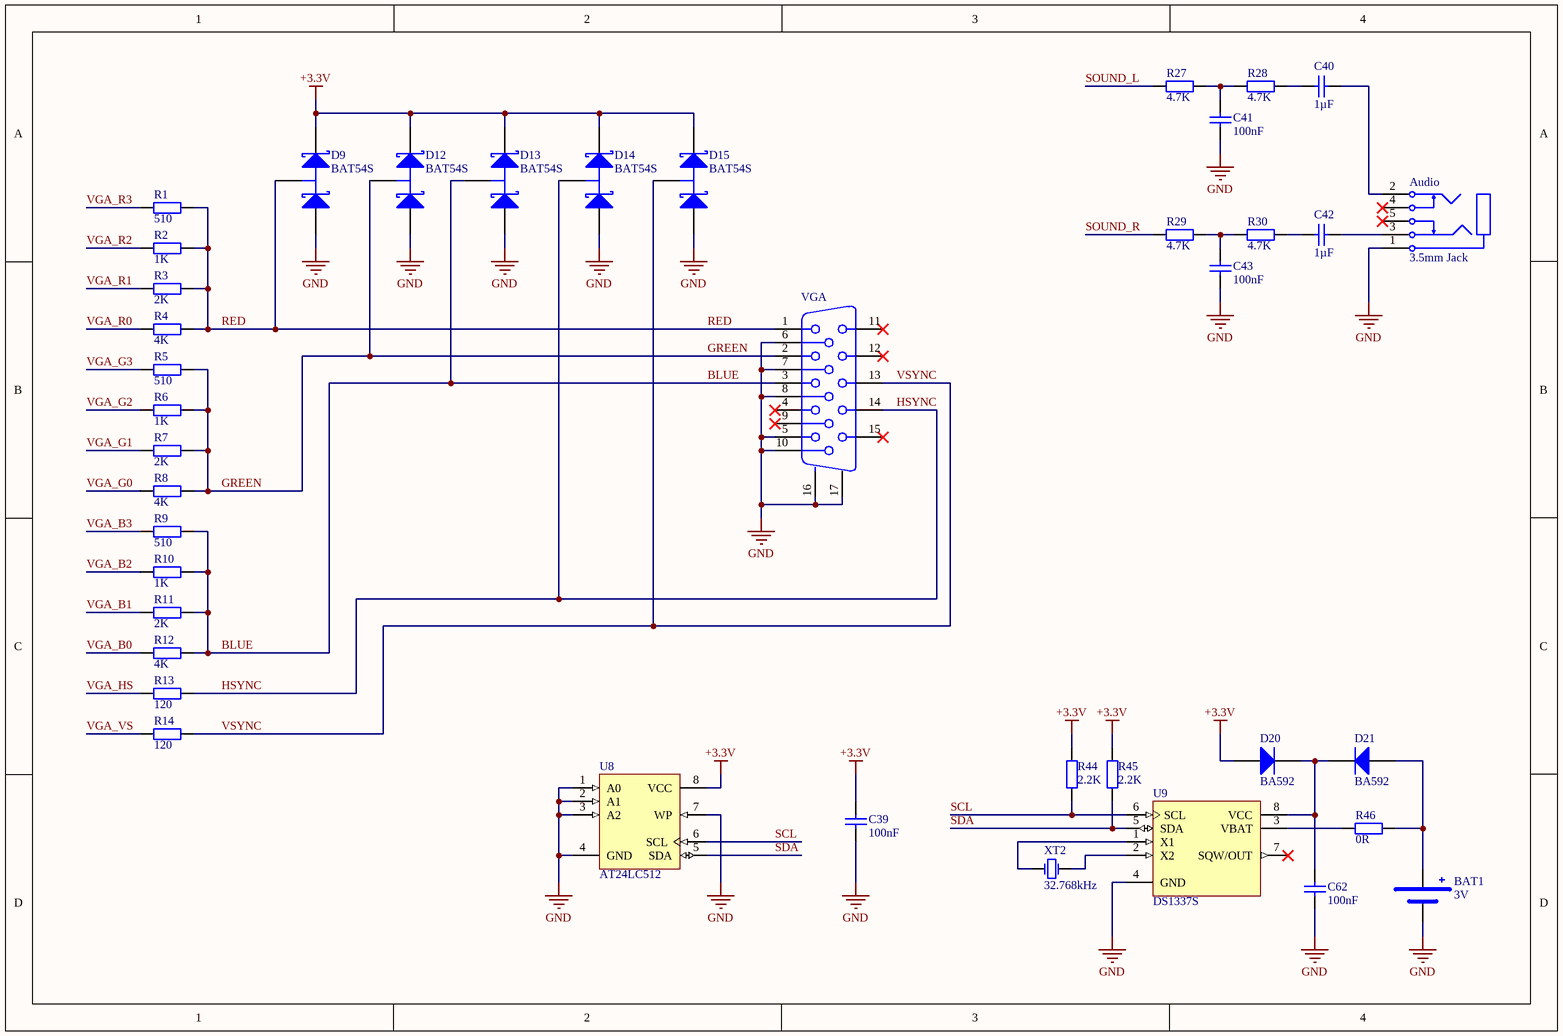
[diagram p4: VGA.SchDoc]

### Parts
Audio  3.5mm Jack  [SJ1-353XNG]
BAT1  3V  [CR2032 HOLDER - Vertical]
C39  value 100nF  [RESC2012N]  (hidden comment: Capacitor)
C40  value 1µF  [6-0805_n]  (hidden comment: Cap)
C41  value 100nF  [6-0805_n]  (hidden comment: Cap)
C42  value 1µF  [6-0805_n]  (hidden comment: Cap)
C43  value 100nF  [6-0805_n]  (hidden comment: Cap)
C62  value 100nF  [RESC2012N]  (hidden comment: Capacitor)
D9  BAT54S  [SOT23_N]
D12  BAT54S  [SOT23_N]
D13  BAT54S  [SOT23_N]
D14  BAT54S  [SOT23_N]
D15  BAT54S  [SOT23_N]
D20  BA592  [SOD-323]
D21  BA592  [SOD-323]
R1  value 510  [6-0805_N]  (hidden comment: Res2)
R2  value 1K  [6-0805_N]  (hidden comment: Res2)
R3  value 2K  [6-0805_N]  (hidden comment: Res2)
R4  value 4K  [6-0805_N]  (hidden comment: Res2)
R5  value 510  [6-0805_N]  (hidden comment: Res2)
R6  value 1K  [6-0805_N]  (hidden comment: Res2)
R7  value 2K  [6-0805_N]  (hidden comment: Res2)
R8  value 4K  [6-0805_N]  (hidden comment: Res2)
R9  value 510  [6-0805_N]  (hidden comment: Res2)
R10  value 1K  [6-0805_N]  (hidden comment: Res2)
R11  value 2K  [6-0805_N]  (hidden comment: Res2)
R12  value 4K  [6-0805_N]  (hidden comment: Res2)
R13  value 120  [6-0805_N]  (hidden comment: Res2)
R14  value 120  [6-0805_N]  (hidden comment: Res2)
R27  value 4.7K  [6-0805_N]  (hidden comment: Res2)
R28  value 4.7K  [6-0805_N]  (hidden comment: Res2)
R29  value 4.7K  [6-0805_N]  (hidden comment: Res2)
R30  value 4.7K  [6-0805_N]  (hidden comment: Res2)
R44  value 2.2K  [RESC2012N]  (hidden comment: Resistor)
R45  value 2.2K  [RESC2012N]  (hidden comment: Resistor)
R46  value 0R  [RESC2012N]  (hidden comment: Resistor)
U8  AT24LC512  [8S1_N]
U9  DS1337S  [SOIC8N_N]
VGA  Video  [VGA Connector]  (value not drawn)
XT2  value 32.768kHz  [SMD Clock Quarz]  (hidden comment: XTAL)

### Nets
+3.3V: C39.1 D9.2(K) D12.2(K) D13.2(K) D14.2(K) D15.2(K) D20.2(A) R44.2 R45.2 U8.8(VCC)
GND: Audio.1 BAT1.2 C39.2 C41.1 C43.1 C62.2 D9.1(A) D12.1(A) D13.1(A) D14.1(A) D15.1(A) U8.1(A0) U8.2(A1) U8.3(A2) U8.4(GND) U8.7(WP) U9.4(GND) VGA.5 VGA.6 VGA.7 VGA.8 VGA.10 VGA.16(MH1) VGA.17(MH2)
BLUE: D13.3(C) R9.1 R10.1 R11.1 R12.1 VGA.3
GREEN: D12.3(C) R5.1 R6.1 R7.1 R8.1 VGA.2
HSYNC: D14.3(C) R13.1 VGA.14
RED: D9.3(C) R1.1 R2.1 R3.1 R4.1 VGA.1
SCL: R44.1 U8.6(SCL) U9.6(SCL)
SDA: R45.1 U8.5(SDA) U9.5(SDA)
SOUND_L: R27.1
SOUND_R: R29.1
VGA_B0: R12.2
VGA_B1: R11.2
VGA_B2: R10.2
VGA_B3: R9.2
VGA_G0: R8.2
VGA_G1: R7.2
VGA_G2: R6.2
VGA_G3: R5.2
VGA_HS: R13.2
VGA_R0: R4.2
VGA_R1: R3.2
VGA_R2: R2.2
VGA_R3: R1.2
VGA_VS: R14.2
VSYNC: D15.3(C) R14.1 VGA.13
NetAudio_2: Audio.2 C40.1
NetAudio_3: Audio.3 C42.1
NetBAT1_1: BAT1.1 D21.2(A) R46.1
NetC40_2: C40.2 R28.2
NetC41_2: C41.2 R27.2 R28.1
NetC42_2: C42.2 R30.1
NetC43_2: C43.2 R29.2 R30.2
NetC62_1: C62.1 D20.1(K) D21.1(K) U9.8(VCC)
NetR46_2: R46.2 U9.3(VBAT)
NetU9_1: U9.1(X1) XT2.1(OSC1)
NetU9_2: U9.2(X2) XT2.2(OSC2)

Not connected (* = marked no-connect by the designer): Audio 4* 5*; U9 7(SQW/OUT)*; VGA 4* 9* 11* 12* 15*

### Notes on the sheet
- Title
- Size:
- Date:
- A4
- Number:
- Time:
- Revision:
- Sheet
- of
- File:

### Library data of the parts
Audio = Phono Jack
BAT1 = CR2032 Battery
C40-C43 = Cap: Capacitor; Published: 8-Jun-2000; LatestRevisionDate: 17-Jul-2002; LatestRevisionNote: Re-released for DXP Platform.; PackageReference: RAD-0.3; Publisher: Altium Limited; PackageDescription: Radial Cap, Thru-Hole; 2 Leads; 0.3 in Pin Spacing
D9 D12-D15 = BAT54S: Schottky Barrier Double Diode; Published: 17-Sep-2003; LatestRevisionDate: 12-Dec-2006; LatestRevisionNote: IPC-7351 Footprint Added.; DatasheetVersion: 4-Mar-2002; PackageVersion: May-1999; PackageReference: SOT23; Publisher: Altium Limited; PackageDescription: 3-Pin SOT-23 Package 0.95 mm Pitch, 2.3 mm Lead Span; ComponentLink1Description: Manufacturer Link; ComponentLink1URL: http://www.semiconductors.philips.com/; ComponentLink2Description: Datasheet; ComponentLink2URL: http://www.semiconductors.philips.com/acrobat/datasheets/BAT54_SERIES_4.pdf
D20 D21 = BA592: Silicon RF Switching Diode for VHF Band Switching in TV/VTR Tuners; Published: 21-Mar-2003; LatestRevisionDate: 19-Mar-2004; LatestRevisionNote: Silkscreen size reduced.; DatasheetDocument: Oct-1999; PackageDocument: Sep-2000; PackageReference: SOD-323; Publisher: Altium Limited; ComponentLink1Description: Manufacturer Link; ComponentLink1URL: http://www.infineon.com/; ComponentLink2Description: Datasheet; ComponentLink2URL: http://www.infineon.com/upload/Document/cmc_upload/documents/080/120/ba592_ba892series_1.pdf
R1-R14 R27-R30 = Res2: Resistor; Published: 8-Jun-2000; LatestRevisionDate: 17-Jul-2002; LatestRevisionNote: Re-released for DXP Platform.; PackageReference: AXIAL-0.4; Publisher: Altium Limited; PackageDescription: Axial Device, Thru-Hole; 2 Leads; 0.4 in Pin Spacing
U8 = AT24C01BN-SP25-B: 1Kbit (128 x 8), 2-wire Bus Automotive Serial EEPROM with Write Protect, 2.5V, 8-Pin SOIC, Bulk; Published: 20-Sep-2010; DatasheetVersion: 8517C,  Jan-2009; PackageVersion: revC, Mar-2005; PackageReference: 8S1; Publisher: Altium Limited; PackageDescription: 8-Lead (0.150" Wide Body), Plastic Gull Wing Small Outline (JEDEC SOIC); Code_JEDEC: MS-012-AA; Code_IPC: SOIC127P600-8; ComponentLink1Description: Manufacturer Link; ComponentLink1URL: http://www.atmel.com/products/serial/default.asp; ComponentLink2Description: Datasheet; ComponentLink2URL: http://www.atmel.com/dyn/resources/prod_documents/doc8517.pdf; ComponentLink3Description: Atmel.com Home; ComponentLink3URL: http://www.atmel.com
U9 = DS1307Z: 64 X 8 Serial Real-Time Clock; Published: 13-Oct-2000; LatestRevisionDate: 13-Apr-2006; LatestRevisionNote: IPC-7351 Footprint Added.; DatasheetVersion: 10-Aug-1999; PackageVersion: 1999; PackageReference: SOIC8N; Publisher: Altium Limited; PackageDescription: 8-Pin Small Outline Integrated Circuit 1.27 mm Pitch; Code_IPC: SOIC127P600-8; ComponentLink1Description: Manufacturer Link; ComponentLink1URL: http://www.maxim-ic.com/; ComponentLink2Description: Datasheet; ComponentLink2URL: http://pdfserv.maxim-ic.com/en/ds/DS1307.pdf; ComponentLink3Description: Discontinuation Notice; ComponentLink3URL: http://www.maxim-ic.com/qa/pdfs/non-obsolescence-letter.pdf
VGA = VGA Connector
C39 C62 = Capacitor: Published: 8-Jun-2000; LatestRevisionDate: 17-Jul-2002; LatestRevisionNote: Re-released for DXP Platform.; PackageReference: RAD-0.3; Publisher: Altium Limited; PackageDescription: Radial Cap, Thru-Hole; 2 Leads; 0.3 in Pin Spacing
R44-R46 = Resistor: Published: 8-Jun-2000; LatestRevisionDate: 17-Jul-2002; LatestRevisionNote: Re-released for DXP Platform.; PackageReference: AXIAL-0.4; Publisher: Altium Limited; PackageDescription: Axial Device, Thru-Hole; 2 Leads; 0.4 in Pin Spacing

## Sheet PS2.SchDoc
size A4
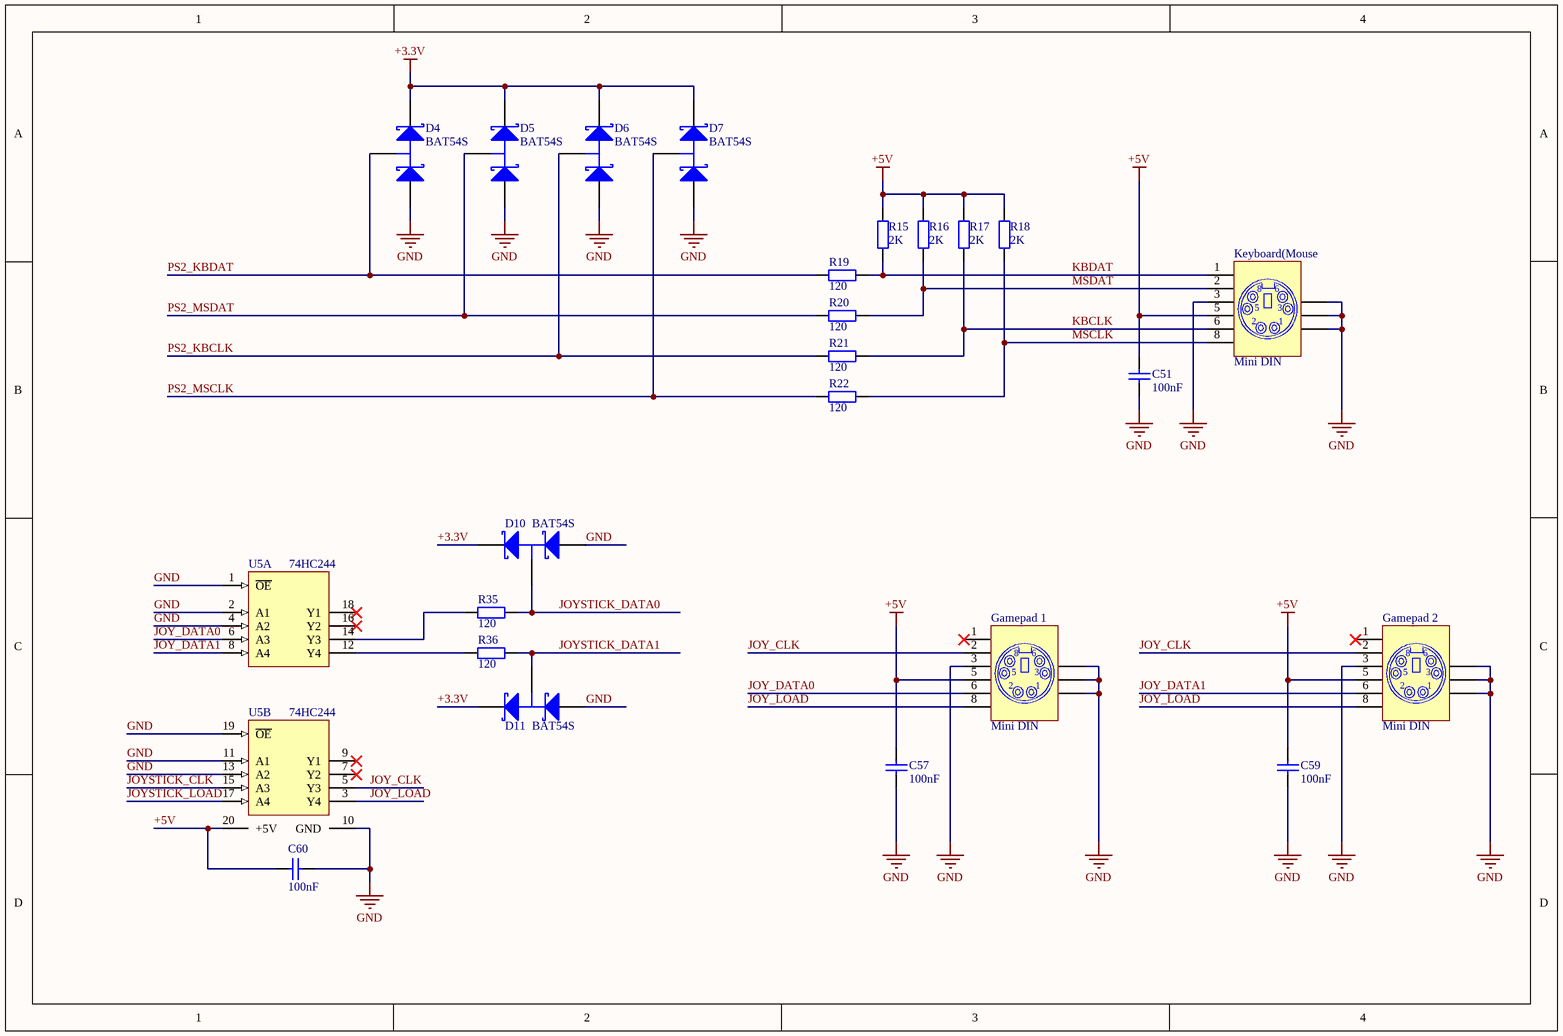
[diagram p5: PS2.SchDoc]

### Parts
C51  value 100nF  [6-0805_n]  (hidden comment: Cap)
C57  value 100nF  [6-0805_n]  (hidden comment: Cap)
C59  value 100nF  [6-0805_n]  (hidden comment: Cap)
C60  value 100nF  [6-0805_n]  (hidden comment: Cap)
D4  BAT54S  [SOT23_N]
D5  BAT54S  [SOT23_N]
D6  BAT54S  [SOT23_N]
D7  BAT54S  [SOT23_N]
D10  BAT54S  [SOT23_N]
D11  BAT54S  [SOT23_N]
Gamepad_1  Mini DIN  [Mini DIN PS/2]
Gamepad_2  Mini DIN  [Mini DIN PS/2]
Keyboard(Mouse  Mini DIN  [Mini DIN PS/2]
R15  value 2K  [6-0805_N]  (hidden comment: Res2)
R16  value 2K  [6-0805_N]  (hidden comment: Res2)
R17  value 2K  [6-0805_N]  (hidden comment: Res2)
R18  value 2K  [6-0805_N]  (hidden comment: Res2)
R19  value 120  [6-0805_N]  (hidden comment: Res2)
R20  value 120  [6-0805_N]  (hidden comment: Res2)
R21  value 120  [6-0805_N]  (hidden comment: Res2)
R22  value 120  [6-0805_N]  (hidden comment: Res2)
R35  value 120  [6-0805_N]  (hidden comment: Res2)
R36  value 120  [6-0805_N]  (hidden comment: Res2)
U5  74HC244  [948E-02_N]  (parts A,B of 2)

### Nets
+3.3V: D4.2(K) D5.2(K) D6.2(K) D7.2(K) D10.2(K) D11.2(K)
+5V: C51.2 C57.2 C59.2 C60.2 Gamepad_1.5 Gamepad_2.5 Keyboard(Mouse.5 R15.1 R16.1 R17.1 R18.1 U5.20(VDD)
GND: C51.1 C57.1 C59.1 C60.1 D4.1(A) D5.1(A) D6.1(A) D7.1(A) D10.1(A) D11.1(A) Gamepad_1.3 Gamepad_1.MH1 Gamepad_1.MH2 Gamepad_1.MH3 Gamepad_2.3 Gamepad_2.MH1 Gamepad_2.MH2 Gamepad_2.MH3 Keyboard(Mouse.3 Keyboard(Mouse.MH1 Keyboard(Mouse.MH2 Keyboard(Mouse.MH3 U5.1(~{OE}) U5.2(A1) U5.4(A2) U5.10(GND) U5.11(A1) U5.13(A2) U5.19(~{OE})
JOY_CLK: Gamepad_1.2 Gamepad_2.2 U5.5(Y3)
JOY_DATA0: Gamepad_1.6 U5.6(A3)
JOY_DATA1: Gamepad_2.6 U5.8(A4)
JOY_LOAD: Gamepad_1.8 Gamepad_2.8 U5.3(Y4)
JOYSTICK_CLK: U5.15(A3)
JOYSTICK_DATA0: D10.3(C) R35.1
JOYSTICK_DATA1: D11.3(C) R36.1
JOYSTICK_LOAD: U5.17(A4)
KBCLK: Keyboard(Mouse.6 R17.2 R21.2
KBDAT: Keyboard(Mouse.1 R15.2 R19.2
MSCLK: Keyboard(Mouse.8 R18.2 R22.2
MSDAT: Keyboard(Mouse.2 R16.2 R20.2
PS2_KBCLK: D6.3(C) R21.1
PS2_KBDAT: D4.3(C) R19.1
PS2_MSCLK: D7.3(C) R22.1
PS2_MSDAT: D5.3(C) R20.1
NetR35_2: R35.2 U5.14(Y3)
NetR36_2: R36.2 U5.12(Y4)

Not connected (* = marked no-connect by the designer): Gamepad_1 1*; Gamepad_2 1*; U5 7(Y2)* 9(Y1)* 16(Y2)* 18(Y1)*

### Notes on the sheet
- Title
- Size:
- Date:
- A4
- Number:
- Time:
- Revision:
- Sheet
- of
- File:

### Library data of the parts
C51 C57 C59 C60 = Cap: Capacitor; Published: 8-Jun-2000; LatestRevisionDate: 17-Jul-2002; LatestRevisionNote: Re-released for DXP Platform.; PackageReference: RAD-0.3; Publisher: Altium Limited; PackageDescription: Radial Cap, Thru-Hole; 2 Leads; 0.3 in Pin Spacing
D4-D7 D10 D11 = BAT54S: Schottky Barrier Double Diode; Published: 17-Sep-2003; LatestRevisionDate: 12-Dec-2006; LatestRevisionNote: IPC-7351 Footprint Added.; DatasheetVersion: 4-Mar-2002; PackageVersion: May-1999; PackageReference: SOT23; Publisher: Altium Limited; PackageDescription: 3-Pin SOT-23 Package 0.95 mm Pitch, 2.3 mm Lead Span; ComponentLink1Description: Manufacturer Link; ComponentLink1URL: http://www.semiconductors.philips.com/; ComponentLink2Description: Datasheet; ComponentLink2URL: http://www.semiconductors.philips.com/acrobat/datasheets/BAT54_SERIES_4.pdf
Gamepad_1 Gamepad_2 Keyboard(Mouse = Mini DIN PS/2
R15-R22 R35 R36 = Res2: Resistor; Published: 8-Jun-2000; LatestRevisionDate: 17-Jul-2002; LatestRevisionNote: Re-released for DXP Platform.; PackageReference: AXIAL-0.4; Publisher: Altium Limited; PackageDescription: Axial Device, Thru-Hole; 2 Leads; 0.4 in Pin Spacing
U5 = MC74HC244ADW: Octal 3-State Non-Inverting Buffer/Line Driver/Line Receiver; Published: 15-Apr-2002; LatestRevisionDate: 13-Apr-2006; LatestRevisionNote: IPC-7351 Footprint Added.; DatasheetVersion: Mar-2000; PackageReference: 751D-05; Publisher: Altium Limited; PackageDescription: 20-Pin Small Outline Integrated Circuit 1.27 mm Pitch; ComponentLink1Description: Manufacturer Link; ComponentLink1URL: http://www.onsemi.com/; ComponentLink2Description: Datasheet; ComponentLink2URL: http://www.onsemi.com/pub/Collateral/MC74HC244A-D.PDF

## Nets that join several sheets
+3.3V: Power Supply (36 pins), FPGA Banks (10 pins), Memory (25 pins), Controller (28 pins), VGA (10 pins), PS2 (6 pins)
+5V: Power Supply (5 pins), Controller (C55.2 J4.23 J4.24), PS2 (12 pins)
GND: Power Supply (49 pins), FPGA Banks (9 pins), Memory (20 pins), Controller (25 pins), VGA (24 pins), PS2 (29 pins)
VBUS: Power Supply (C23.2 D1.1), Controller (J2.1 R31.1)
CCLK: FPGA Banks (U1.70), Controller (U10.43)
COMM1: FPGA Banks (U1.51), Controller (U10.47)
COMM2: FPGA Banks (U1.50), Controller (U10.48)
COMM3: FPGA Banks (U1.48), Controller (U10.49)
COMM4: FPGA Banks (U1.47), Controller (U10.50)
COMM5: FPGA Banks (U1.46), Controller (U10.51)
COMM6: FPGA Banks (U1.45), Controller (U10.52)
DIN: FPGA Banks (U1.65), Controller (U10.45)
DONE: FPGA Banks (R39.2 U1.71), Controller (U10.42)
FFLCS: FPGA Banks (U1.43), Memory (R41.8 U7.6)
FMOSI: FPGA Banks (U1.41), Memory (U7.13)
FSCK: FPGA Banks (U1.40), Memory (U7.10)
FSDCS: FPGA Banks (U1.44), Memory (R41.4 U7.3)
INIT_B: FPGA Banks (U1.39), Controller (R26.7 U10.53)
JOYSTICK_CLK: FPGA Banks (U1.119), PS2 (U5.15)
JOYSTICK_DATA0: FPGA Banks (U1.120), PS2 (D10.3 R35.1)
JOYSTICK_DATA1: FPGA Banks (U1.121), PS2 (D11.3 R36.1)
JOYSTICK_LOAD: FPGA Banks (U1.118), PS2 (U5.17)
M0: FPGA Banks (U1.69), Controller (U10.44)
M1: FPGA Banks (U1.60), Controller (U10.46)
MFLCS: Memory (U6.4 U7.7), Controller (D16.2)
MMISO: FPGA Banks (U1.38), Memory (SD0.7 U6.8), Controller (R26.5 U10.6)
MSDCS: Memory (SD0.1 U7.4), Controller (D81.2)
PFLCS: Memory (R41.6 U7.5), Controller (U10.62)
PMOSI: Memory (U7.14), Controller (U10.4)
PROG: FPGA Banks (U1.37), Controller (R26.3 U10.54)
PS2_KBCLK: FPGA Banks (U1.58), PS2 (D6.3 R21.1)
PS2_KBDAT: FPGA Banks (U1.57), PS2 (D4.3 R19.1)
PS2_MSCLK: FPGA Banks (U1.55), PS2 (D7.3 R22.1)
PS2_MSDAT: FPGA Banks (U1.56), PS2 (D5.3 R20.1)
PSCK: Memory (U7.11), Controller (U10.5)
PSDCS: Memory (R41.2 U7.2), Controller (U10.63)
SCL: Controller (J4.4 U10.2), VGA (R44.1 U8.6 U9.6)
SDA: Controller (J4.3 U10.3), VGA (R45.1 U8.5 U9.5)
SDCD: Memory (R38.2 SD0.10), Controller (U10.61)
SDWP: Memory (R34.2 SD0.11), Controller (U10.60)
SOUND_L: FPGA Banks (U1.84), VGA (R27.1)
SOUND_R: FPGA Banks (U1.85), VGA (R29.1)
SPI_MUX: Memory (R48.2 U7.1), Controller (U10.64)
SRAM_A0: FPGA Banks (U1.14), Memory (SRAM0.5 SRAM1.5)
SRAM_A1: FPGA Banks (U1.15), Memory (SRAM0.4 SRAM1.4)
SRAM_A2: FPGA Banks (U1.16), Memory (SRAM0.3 SRAM1.3)
SRAM_A3: FPGA Banks (U1.17), Memory (SRAM0.2 SRAM1.2)
SRAM_A4: FPGA Banks (U1.21), Memory (SRAM0.1 SRAM1.1)
SRAM_A5: FPGA Banks (U1.34), Memory (SRAM0.44 SRAM1.44)
SRAM_A6: FPGA Banks (U1.33), Memory (SRAM0.43 SRAM1.43)
SRAM_A7: FPGA Banks (U1.32), Memory (SRAM0.42 SRAM1.42)
SRAM_A8: FPGA Banks (U1.133), Memory (SRAM0.28 SRAM1.28)
SRAM_A9: FPGA Banks (U1.132), Memory (SRAM0.27 SRAM1.27)
SRAM_A10: FPGA Banks (U1.131), Memory (SRAM0.26 SRAM1.26)
SRAM_A11: FPGA Banks (U1.127), Memory (SRAM0.25 SRAM1.25)
SRAM_A12: FPGA Banks (U1.126), Memory (SRAM0.24 SRAM1.24)
SRAM_A13: FPGA Banks (U1.124), Memory (SRAM0.23 SRAM1.23)
SRAM_A14: FPGA Banks (U1.140), Memory (SRAM0.22 SRAM1.22)
SRAM_A15: FPGA Banks (U1.141), Memory (SRAM0.21 SRAM1.21)
SRAM_A16: FPGA Banks (U1.142), Memory (SRAM0.20 SRAM1.20)
SRAM_A17: FPGA Banks (U1.143), Memory (SRAM0.19 SRAM1.19)
SRAM_A18: FPGA Banks (U1.144), Memory (SRAM0.18 SRAM1.18)
SRAM_CE0: FPGA Banks (U1.12), Memory (R23.2 SRAM0.6)
SRAM_CE1: FPGA Banks (U1.35), Memory (R24.2 SRAM1.6)
SRAM_D0: FPGA Banks (U1.11), Memory (SRAM0.7 SRAM1.7)
SRAM_D1: FPGA Banks (U1.10), Memory (SRAM0.8 SRAM1.8)
SRAM_D2: FPGA Banks (U1.9), Memory (SRAM0.9 SRAM1.9)
SRAM_D3: FPGA Banks (U1.8), Memory (SRAM0.10 SRAM1.10)
SRAM_D4: FPGA Banks (U1.7), Memory (SRAM0.13 SRAM1.13)
SRAM_D5: FPGA Banks (U1.6), Memory (SRAM0.14 SRAM1.14)
SRAM_D6: FPGA Banks (U1.5), Memory (SRAM0.15 SRAM1.15)
SRAM_D7: FPGA Banks (U1.2), Memory (SRAM0.16 SRAM1.16)
SRAM_D8: FPGA Banks (U1.134), Memory (SRAM0.29 SRAM1.29)
SRAM_D9: FPGA Banks (U1.137), Memory (SRAM0.30 SRAM1.30)
SRAM_D10: FPGA Banks (U1.138), Memory (SRAM0.31 SRAM1.31)
SRAM_D11: FPGA Banks (U1.139), Memory (SRAM0.32 SRAM1.32)
SRAM_D12: FPGA Banks (U1.22), Memory (SRAM0.35 SRAM1.35)
SRAM_D13: FPGA Banks (U1.23), Memory (SRAM0.36 SRAM1.36)
SRAM_D14: FPGA Banks (U1.24), Memory (SRAM0.37 SRAM1.37)
SRAM_D15: FPGA Banks (U1.26), Memory (SRAM0.38 SRAM1.38)
SRAM_LB: FPGA Banks (U1.27), Memory (SRAM0.39 SRAM1.39)
SRAM_OE: FPGA Banks (U1.30), Memory (SRAM0.41 SRAM1.41)
SRAM_UB: FPGA Banks (U1.29), Memory (SRAM0.40 SRAM1.40)
SRAM_WE: FPGA Banks (U1.1), Memory (SRAM0.17 SRAM1.17)
VGA_B0: FPGA Banks (U1.62), VGA (R12.2)
VGA_B1: FPGA Banks (U1.64), VGA (R11.2)
VGA_B2: FPGA Banks (U1.66), VGA (R10.2)
VGA_B3: FPGA Banks (U1.67), VGA (R9.2)
VGA_G0: FPGA Banks (U1.74), VGA (R8.2)
VGA_G1: FPGA Banks (U1.75), VGA (R7.2)
VGA_G2: FPGA Banks (U1.78), VGA (R6.2)
VGA_G3: FPGA Banks (U1.79), VGA (R5.2)
VGA_HS: FPGA Banks (U1.61), VGA (R13.2)
VGA_R0: FPGA Banks (U1.80), VGA (R4.2)
VGA_R1: FPGA Banks (U1.81), VGA (R3.2)
VGA_R2: FPGA Banks (U1.82), VGA (R2.2)
VGA_R3: FPGA Banks (U1.83), VGA (R1.2)
VGA_VS: FPGA Banks (U1.59), VGA (R14.2)